# EAGLE design tiny (EAGLE 7.1.0)
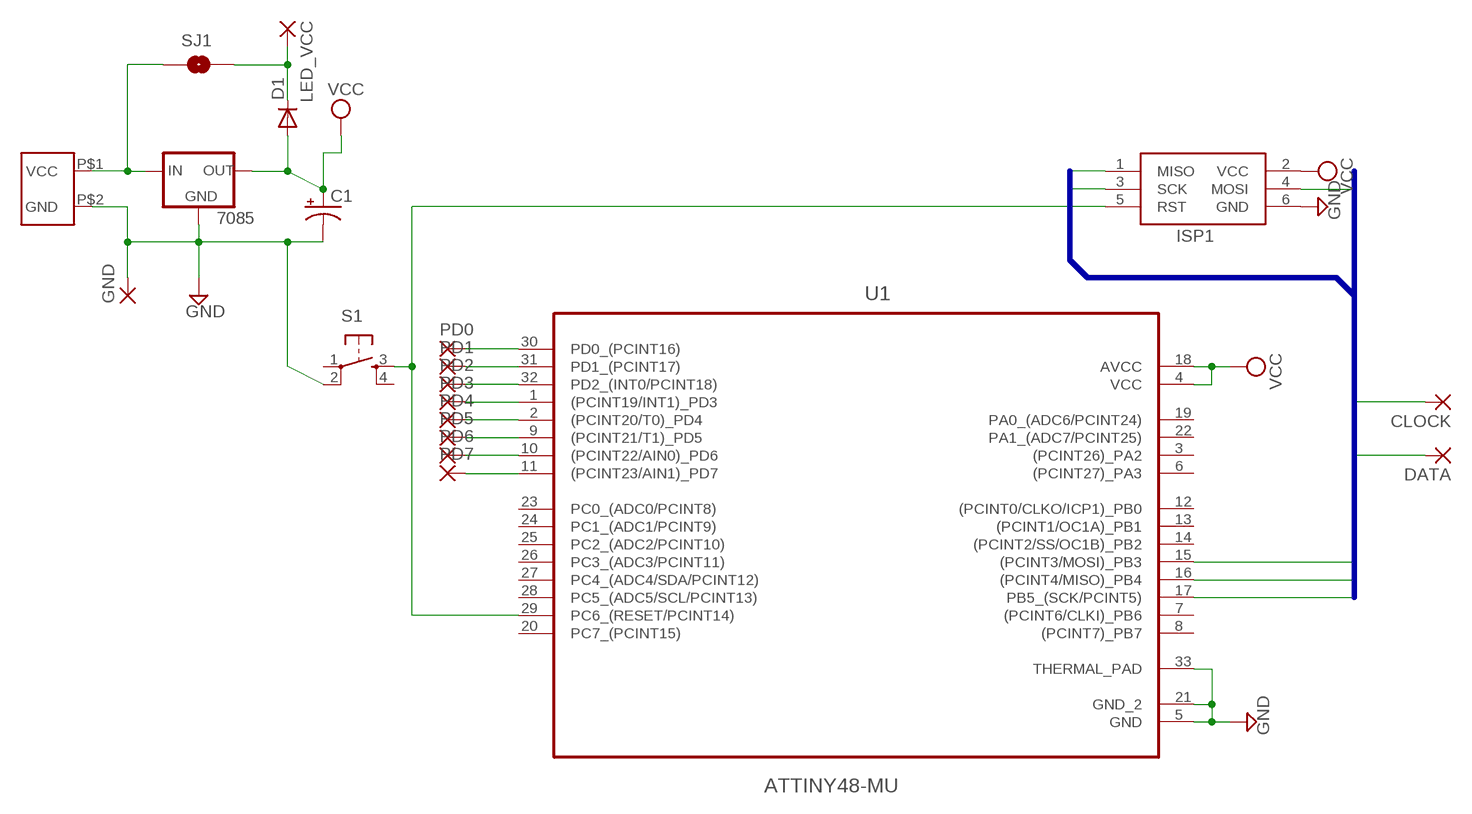
[diagram p0: schematic, sheet 1]

## Parts
7085  V_REG_78XXSIDE  [78XXL]
C1  CPOL-USE2.5-6  [E2,5-6]
CLOCK  2,54/1,0  [2,54/1,0]
D1  DIODE1N4148  [DIODE-1N4148]
DATA  2,54/1,0  [2,54/1,0]
GND  2,54/1,0  [2,54/1,0]
ISP1  AVRISP-6  [AVRISP]
LED_VCC  2,54/1,0  [2,54/1,0]
PD0  1,6/0,9  [1,6/0,9]
PD1  1,6/0,9  [1,6/0,9]
PD2  1,6/0,9  [1,6/0,9]
PD3  1,6/0,9  [1,6/0,9]
PD4  1,6/0,9  [1,6/0,9]
PD5  1,6/0,9  [1,6/0,9]
PD6  1,6/0,9  [1,6/0,9]
PD7  1,6/0,9  [1,6/0,9]
S1  TAC_SWITCHSMD  [TACTILE_SWITCH_SMD]
SJ1  LED_VCC = VCC  SOLDERJUMPERNO  [SJ_2S-NO]
U1  ATTINY48-MU  [QFN50P500X500X100-33N]
VCC  OSTOQ023251  [OSTOQ023251]

## Nets
GND: 7085.GND C1.- GND.1(P) ISP1.6(GND) S1.2 U1.5(GND) U1.21(GND_2) U1.33(THERMAL_PAD) VCC.P$2(GND)
MISO: ISP1.1(MISO) U1.16((PCINT4/MISO)_PB4)
MOSI: DATA.1(P) ISP1.4(MOSI) U1.15((PCINT3/MOSI)_PB3)
N$4: ISP1.5(RST) S1.3 U1.29(PC6_(RESET/PCINT14))
N$6: 7085.IN SJ1.1 VCC.P$1(VCC)
N$32: PD0.1(P) U1.30(PD0_(PCINT16))
N$33: PD1.1(P) U1.31(PD1_(PCINT17))
N$34: PD2.1(P) U1.32(PD2_(INT0/PCINT18))
N$35: PD3.1(P) U1.1((PCINT19/INT1)_PD3)
N$36: PD4.1(P) U1.2((PCINT20/T0)_PD4)
N$37: PD5.1(P) U1.9((PCINT21/T1)_PD5)
N$38: PD6.1(P) U1.10((PCINT22/AIN0)_PD6)
N$39: PD7.1(P) U1.11((PCINT23/AIN1)_PD7)
N$40: D1.C LED_VCC.1(P) SJ1.2
SCK: CLOCK.1(P) ISP1.3(SCK) U1.17(PB5_(SCK/PCINT5))
VCC: 7085.OUT C1.+ D1.A ISP1.2(VCC) U1.4(VCC) U1.18(AVCC)
Unconnected: S1.1 S1.4 U1.3((PCINT26)_PA2) U1.6((PCINT27)_PA3) U1.7((PCINT6/CLKI)_PB6) U1.8((PCINT7)_PB7) U1.12((PCINT0/CLKO/ICP1)_PB0) U1.13((PCINT1/OC1A)_PB1) U1.14((PCINT2/SS/OC1B)_PB2) U1.19(PA0_(ADC6/PCINT24)) U1.20(PC7_(PCINT15)) U1.22(PA1_(ADC7/PCINT25)) U1.23(PC0_(ADC0/PCINT8)) U1.24(PC1_(ADC1/PCINT9)) U1.25(PC2_(ADC2/PCINT10)) U1.26(PC3_(ADC3/PCINT11)) U1.27(PC4_(ADC4/SDA/PCINT12)) U1.28(PC5_(ADC5/SCL/PCINT13))

## Buses
SCK,MOSI,MISO

## Library data of the parts
7085 = SparkFun:V_REG_78XX: Voltage Regulator Standard 7805 5V regulator. IGO (Input Ground Output). Spark Fun Electronics SKU : COM-00107
C1 = adafruit:CPOL-US: POLARIZED CAPACITOR, American symbol
CLOCK DATA GND LED_VCC = wirepad:2,54/1,0: THROUGH-HOLE PAD
D1 = SparkFun:DIODE: Diode These are standard reverse protection diodes and small signal diodes. SMA package can handle up to about 1A. SOD-323 can handle about 200mA. What the SOD-323 package when ordering, there are some mfgs out there that are 5-pin packages.
ISP1 = adafruit:AVRISP: AVR ISP HEADER Standard 6 pin header for AVR programming
PD0 PD1-PD7 = wirepad:1,6/0,9: THROUGH-HOLE PAD
S1 = SparkFun:TAC_SWITCH: Momentary Switch Button commonly used for reset or general input. Spark Fun Electronics SKU : COM-00097
SJ1 = SparkFun:SOLDERJUMPER: Solder Jumper Standard SMD solder jumper. Used to automate production. Two varients : Normally Open and Normally Closed are the same, but have different paste layers. NC will have a large amount of paste and should jumper during reflow.
U1 = attiny48:ATTINY48-MU: IC, 8BIT MCU, AVR Tiny, 12MHZ, QFN-32; MPN: ATTINY48-MU; OC_FARNELL: 1748547; OC_NEWARK: 68T3773; PACKAGE: QFN-32; SUPPLIER: ATMEL
VCC = phrobo:OSTOQ023251

## Board
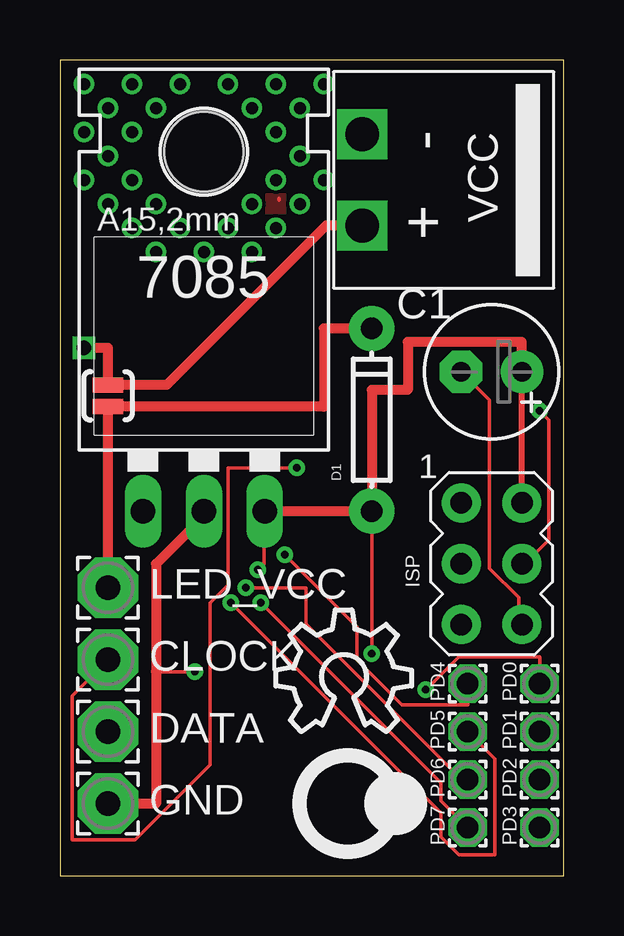
[diagram p1: board, top side]
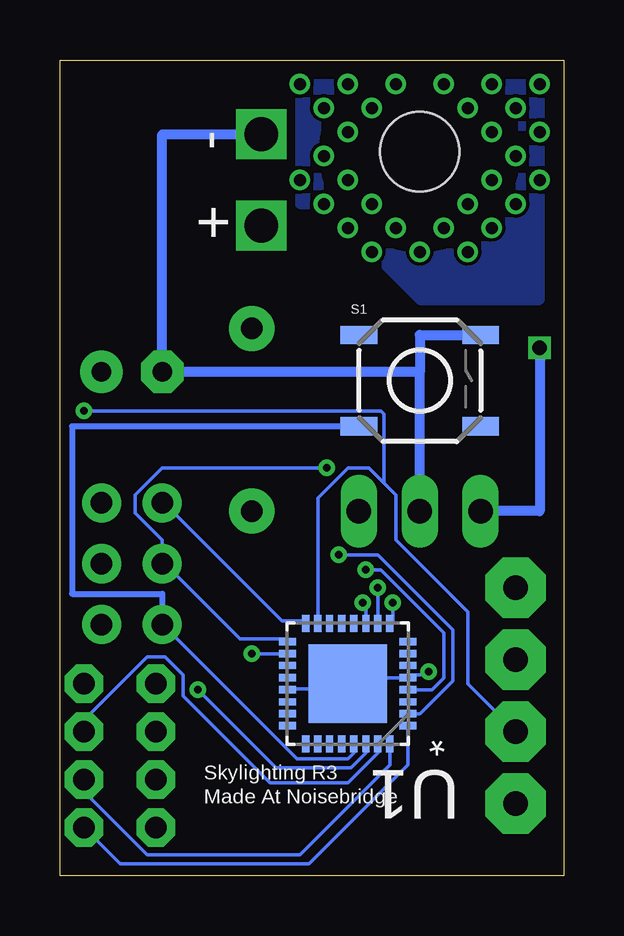
[diagram p2: board, bottom side, seen from below]

Size 21 x 34 mm. Coordinates in mm from the lower left corner, seen from the top.
Outline: 0,0 21,0 21,34 0,34 0,0
Copper layers (1*16): Top 0.0356mm / dielectric 1.5011mm / Bottom 0.0356mm
Design rules "LaenPCBOrder": minimum track width 6mil, minimum drill 13mil, track to track 6mil, track to pad 6mil, pad to pad 6mil, via to via 6mil, smd to smd 6mil, copper to edge 15mil, drill to drill 6mil, minimum pad ring 7mil, minimum via ring 7mil, stop-mask expansion 3mil, vias tented up to drill 0mil, thermal gap 10mil

### Footprints (pad centres in the part's own frame; a part is rotated, then mirrored left to right if it is on the bottom)
78XXL = drill 1.016 long: GND 0,-3.81; IN -2.54,-3.81; OUT 2.54,-3.81 | hole 3.302: 0,11.176
E2,5-6 = drill 0.813 pad 1.778: + -1.27,0 | drill 0.813 pad 1.778 octagon: - 1.27,0
2,54/1,0 = drill 1.016 pad 2.54 octagon: 1 0,0
DIODE-1N4148 = drill 0.9 pad 1.88: A -3.81,0; C 3.81,0
AVRISP = drill 0.9 pad 1.626: 1 -1.27,2.54; 2 1.27,2.54; 3 -1.27,0; 4 1.27,0; 5 -1.27,-2.54; 6 1.27,-2.54
1,6/0,9 = drill 0.914 pad 1.6 octagon: 1 0,0
TACTILE_SWITCH_SMD = smd 1.524 x 0.762: 1 -2.54,1.905; 2 2.54,1.905; 3 -2.54,-1.905; 4 2.54,-1.905
SJ_2S-NO = smd 0.635 x 1.27: 1 -0.45,0; 2 0.45,0
QFN50P500X500X100-33N = smd 0.711 x 0.305: 1 -2.515,1.753; 2 -2.515,1.245; 3 -2.515,0.762; 4 -2.515,0.254; 5 -2.515,-0.254; 6 -2.515,-0.762; 7 -2.515,-1.245; 8 -2.515,-1.753; 17 2.515,-1.753; 18 2.515,-1.245; 19 2.515,-0.762; 20 2.515,-0.254; 21 2.515,0.254; 22 2.515,0.762; 23 2.515,1.245; 24 2.515,1.753 | smd 0.305 x 0.711: 9 -1.753,-2.515; 10 -1.245,-2.515; 11 -0.762,-2.515; 12 -0.254,-2.515; 13 0.254,-2.515; 14 0.762,-2.515; 15 1.245,-2.515; 16 1.753,-2.515; 25 1.753,2.515; 26 1.245,2.515; 27 0.762,2.515; 28 0.254,2.515; 29 -0.254,2.515; 30 -0.762,2.515; 31 -1.245,2.515; 32 -1.753,2.515 | smd 3.251 x 3.251: 33 0,0
OSTOQ023251 = drill 1.4 square: P$1 1.905,-3.4; P$2 -1.905,-3.4

### Placement (x,y rotation side)
7085  6,19 0 top
C1  18,21 180 top
CLOCK  2,9 0 top
D1  13,19 90 top
DATA  2,6 0 top
GND  2,3 0 top
ISP1  18,13 0 top
LED_VCC  2,12 0 top
PD0  20,8 0 top
PD1  20,6 0 top
PD2  20,4 0 top
PD3  20,2 0 top
PD4  17,8 0 top
PD5  17,6 0 top
PD6  17,4 0 top
PD7  17,2 0 top
S1  5.99,20.63 0 bottom
SJ1  2,20 270 top
U1  9,8 180 bottom
U$1  [PHROBO-LOGO]  12,3 0 top
U$2  [OSHW_8X200_NOTEXT]  9,6 0 top
VCC  16,29 270 top

### Tracks (layer width: path | path; a pad name or v marks a point on that pad's centre or on a via)
GND  (via drill 0.33)
  Top 0.152: ISP1.6 19.14,10.52 19.14,11.59 17.92,12.81 17.92,19.82 16.85,20.89 C1.- | 4,8.5 v5.62,8.5
  Top 0.406: GND.1 4,3 4,8.5 4,13 6,15 7085.GND
  Bottom 0.152: U1.21 11.36,7.78 9.23,7.78 9.08,7.93 U1.33 8.93,8.08 8.77,8.24 6.49,8.24 U1.5 6.38,8.38 5.75,8.38 v5.62,8.5
  Bottom 0.406: 7085.GND 6,21 | S1.2 6,22.54 6,21 | VCC.P$2 16.73,30.91 C1.- 6,21
MISO
  Bottom 0.152: U1.16 10.88,10.62 11.75,10.62 16.62,15.5 ISP1.1
MOSI  (via drill 0.33)
  Top 0.152: v20,19.38 20.38,19 20.38,14 19.38,13 ISP1.4
  Bottom 0.152: 7.5,16.38 7,15.88 7,14 4,11 4,8 DATA.1 | 7.5,16.38 8.12,17 9,17 10.25,15.75 10.25,10.62 U1.15 | v20,19.38 7.62,19.38 7.5,19.25 7.5,16.38
N$1  (via drill 0.5)
  other vias: 1,33
N$2  (via drill 0.5)
  other vias: 3,33
N$3  (via drill 0.5)
  other vias: 5,33
N$4
  Bottom 0.152: U1.29 8.75,5.38 8.75,5.12 9,4.88 11.12,4.88 16.62,10.38 ISP1.5
  Bottom 0.254: S1.3 20.5,18.73 20.5,11.75 16.73,11.75 ISP1.5
N$5  (via drill 0.5)
  other vias: 7,33
N$6  (via drill 0.6)
  Top 0.152: VCC.P$1 12.62,27.12 12.62,27.09
  Top 0.406: v1,22 2,22 SJ1.1 4.45,20.45 11.1,27.09 VCC.P$1 12.62,27.09 13,27.09
  Bottom 0.406: v1,22 1,15.19 7085.IN
N$7  (via drill 0.5)
  other vias: 9,33
N$8  (via drill 0.5)
  other vias: 11,33
N$9  (via drill 0.5)
  other vias: 10,32
N$10  (via drill 0.5)
  other vias: 8,32
N$12  (via drill 0.5)
  other vias: 4,32
N$13  (via drill 0.5)
  other vias: 2,32
N$14  (via drill 0.5)
  other vias: 1,31
N$15  (via drill 0.5)
  other vias: 3,31
N$16  (via drill 0.5)
  other vias: 9,31
N$18  (via drill 0.5)
  other vias: 10,30
N$20  (via drill 0.5)
  other vias: 2,30
N$22  (via drill 0.5)
  other vias: 3,29
N$23  (via drill 0.5)
  other vias: 1,29
N$24  (via drill 0.5)
  other vias: 9,29
N$25  (via drill 0.5)
  other vias: 11,29
N$26  (via drill 0.5)
  other vias: 10,28
N$27  (via drill 0.5)
  other vias: 8,28
N$29
  pour Bottom: 1,33 11,33 11,28 10,28 6,24 1,24
N$30
  Top 0.152: 9.12,28.25 9.12,28.17
  pour Top: 1,33 11,33 11,28 10,28 6,24 1,24
N$31  (via drill 0.5)
  other vias: 4,28
N$32  (via drill 0.33)
  Top 0.152: v15.25,7.75 16.62,9.12 20,9.12 PD0.1
  Bottom 0.152: v15.25,7.75 12,4.5 8.88,4.5 8.25,5.12 8.25,5.38 U1.30
N$33
  Bottom 0.152: PD1.1 20,6.5 17.38,9.12 16.62,9.12 15.88,8.38 15.88,7.5 12.25,3.88 9,3.88 7.75,5.12 7.75,5.38 U1.31
N$34
  Bottom 0.152: PD2.1 20,3.5 17.38,0.88 11,0.88 7.25,4.62 7.25,5.38 U1.32
N$35
  Bottom 0.152: PD3.1 18.5,0.5 10.62,0.5 6.5,4.62 6.5,6.12 U1.1
N$36  (via drill 0.33)
  Top 0.152: v9.38,13.38 12.38,10.38 12.38,9 14.25,7.12 17,7.12 PD4.1
  Bottom 0.152: v9.38,13.38 7.75,13.38 4.62,10.25 4.62,8.12 6,6.75 6.38,6.75 U1.2
N$37  (via drill 0.33)
  Top 0.152: v7.12,11.38 15.88,2.62 15.88,1.62 16.62,0.88 18.12,0.88 18.12,4.88 PD5.1
  Bottom 0.152: v7.12,11.38 7.12,10.62 U1.9
N$38  (via drill 0.33)
  Top 0.152: v7.75,12 10.25,12 10.25,10.5 16.75,4 PD6.1
  Bottom 0.152: v7.75,12 7.75,10.62 U1.10
N$39  (via drill 0.33)
  Top 0.152: v8.38,11.38 15.88,3.88 15.88,3.12 PD7.1
  Bottom 0.152: v8.38,11.38 8.25,11.25 8.25,10.62 U1.11
N$40
  Top 0.406: LED_VCC.1 SJ1.2 11,19.55 11,22.81 D1.C
N$41  (via drill 0.5)
  other vias: 2,28
N$42  (via drill 0.5)
  other vias: 3,27
N$44  (via drill 0.5)
  other vias: 5,27
N$45  (via drill 0.5)
  other vias: 7,27
N$46  (via drill 0.5)
  other vias: 9,27
N$47  (via drill 0.5)
  other vias: 6,26
N$48  (via drill 0.5)
  other vias: 8,26
N$49  (via drill 0.5)
  other vias: 4,26
SCK  (via drill 0.33)
  Top 0.152: v9.88,17 7,17 7,12.12 6.25,11.38 6.25,4.62 3.12,1.5 0.5,1.5 0.5,7.5 CLOCK.1
  Bottom 0.152: U1.17 11.62,9.88 13.5,9.88 16.62,13 ISP1.3 16.75,13 16.75,14 17.88,15.12 17.88,15.88 16.75,17 v9.88,17
VCC  (via drill 0.33)
  Top 0.152: v8.25,12.75 8.5,13 8.5,15.12 7085.OUT | D1.A v13,9.25
  Top 0.254: 19.25,21 C1.+ ISP1.2
  Top 0.406: 7085.OUT D1.A 13,20.25 14.5,20.25 14.5,22.25 19.25,22.25 19.25,21
  Bottom 0.152: v8.25,12.75 7.62,12.75 5,10.12 5,8.25 5.5,7.75 6.38,7.75 U1.4 | v13,9.25 11.62,9.25 U1.18

### Text on the board
tNames: - | + | ISP
bNames: - | + | Skylighting R3 | Made At Noisebridge